# EAGLE board msp430f5528 (EAGLE 6.6.0), part 1 of 4
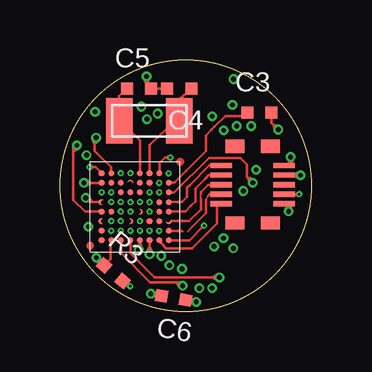
[diagram p5: board, top side]
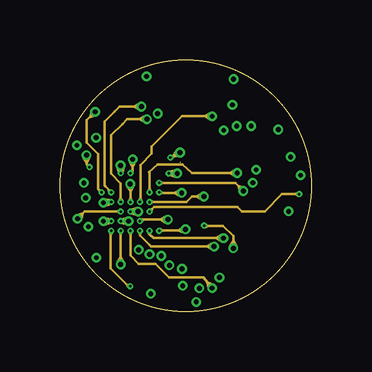
[diagram p6: board, inner layer Route2]
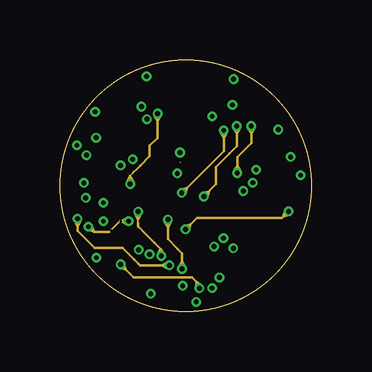
[diagram p7: board, inner layer Route3]
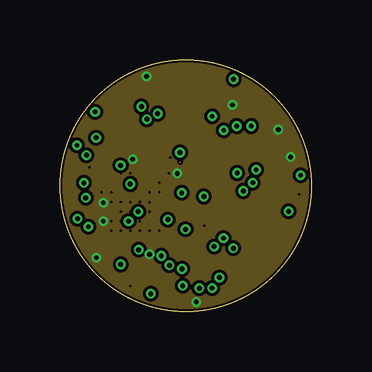
[diagram p8: board, inner layer Route14]
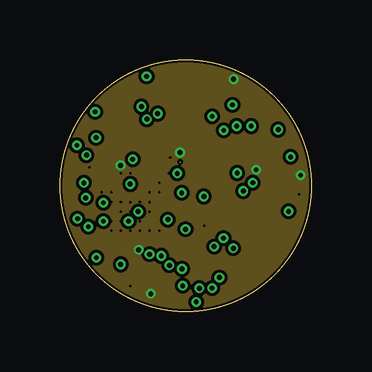
[diagram p9: board, inner layer Route15]
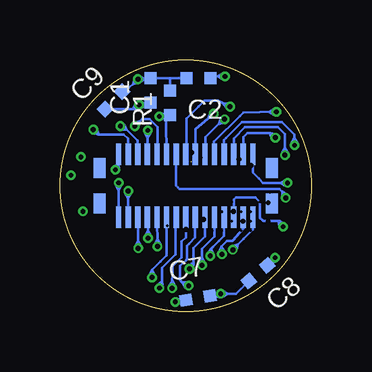
[diagram p10: board, bottom side, seen from below]

Size 10.5 x 10.5 mm. Coordinates in mm from the lower left corner, seen from the top.
Outline: 5.02,6.25 5.02,6.25
Outline: circle at 5.25,5.25 radius 5.25
Copper layers ([2:1+(2*3+14*15)*16]): Top 0.035mm / dielectric 0.2mm / Route2 0.035mm / dielectric 0.2mm / Route3 0.035mm / dielectric 0.2mm / Route14 0.035mm / dielectric 0.2mm / Route15 0.035mm / dielectric 0.2mm / Bottom 0.035mm
Design rules "6_layer_BGA *": minimum track width 0.1mm, minimum drill 0.08mm, track to track 0.081mm, track to pad 0.081mm, pad to pad 0.081mm, via to via 0.081mm, smd to smd 0mil, copper to edge 0.1mm, drill to drill 0.1mm, minimum pad ring 0.05mm, minimum via ring 0.05mm, stop-mask expansion 0mil, vias tented up to drill 10mil, thermal gap 10mil
tKeepout: area 4.7,6 to 5.3,6.5; area 1,2.5 to 1.6,3

## Footprints (pad centres in the part's own frame; a part is rotated, then mirrored left to right if it is on the bottom)
C0402 = smd 0.5 x 0.5: 1 -0.508,0; 2 0.508,0
R0402 = smd 0.5 x 0.5: 1 -0.508,0; 2 0.508,0
YFF64 = smd 0.25 x 0.25: A1 -1.4,1.4; A2 -1,1.4; A3 -0.6,1.4; A4 -0.2,1.4; A5 0.2,1.4; A6 0.6,1.4; A7 1,1.4; A8 1.4,1.4; B1 -1.4,1; B2 -1,1; B3 -0.6,1; B4 -0.2,1; B5 0.2,1; B6 0.6,1; B7 1,1; B8 1.4,1; C1 -1.4,0.6; C2 -1,0.6; C3 -0.6,0.6; C4 -0.2,0.6; C5 0.2,0.6; C6 0.6,0.6; C7 1,0.6; C8 1.4,0.6; D1 -1.4,0.2; D2 -1,0.2; D3 -0.6,0.2; D4 -0.2,0.2; D5 0.2,0.2; D6 0.6,0.2; D7 1,0.2; D8 1.4,0.2; E1 -1.4,-0.2; E2 -1,-0.2; E3 -0.6,-0.2; E4 -0.2,-0.2; E5 0.2,-0.2; E6 0.6,-0.2; E7 1,-0.2; E8 1.4,-0.2; F1 -1.4,-0.6; F2 -1,-0.6; F3 -0.6,-0.6; F4 -0.2,-0.6; F5 0.2,-0.6; F6 0.6,-0.6; F7 1,-0.6; F8 1.4,-0.6; G1 -1.4,-1; G2 -1,-1; G3 -0.6,-1; G4 -0.2,-1; G5 0.2,-1; G6 0.6,-1; G7 1,-1; G8 1.4,-1; H1 -1.4,-1.4; H2 -1,-1.4; H3 -0.6,-1.4; H4 -0.2,-1.4; H5 0.2,-1.4; H6 0.6,-1.4; H7 1,-1.4; H8 1.4,-1.4
ABS07 = smd 1.1 x 1.9: P$1 -1.25,0; P$2 1.25,0
55909-0374_PLUG = smd 0.9 x 0.22: P$1 -1.315,2.8; P$2 -1.315,2.4; P$3 -1.315,2; P$4 -1.315,1.6; P$5 -1.315,1.2; P$6 -1.315,0.8; P$7 -1.315,0.4; P$8 -1.315,0; P$9 -1.315,-0.4; P$10 -1.315,-0.8; P$11 -1.315,-1.2; P$12 -1.315,-1.6; P$13 -1.315,-2; P$14 -1.315,-2.4; P$15 -1.315,-2.8; P$16 1.315,-2.8; P$17 1.315,-2.4; P$18 1.315,-2; P$19 1.315,-1.6; P$20 1.315,-1.2; P$21 1.315,-0.8; P$22 1.315,-0.4; P$23 1.315,0; P$24 1.315,0.4; P$25 1.315,0.8; P$26 1.315,1.2; P$27 1.315,1.6; P$28 1.315,2; P$29 1.315,2.4; P$30 1.315,2.8 | smd 0.85 x 0.5: P$31 -0.74,-3.6; P$32 0.74,-3.6; P$33 -0.74,3.6; P$34 0.74,3.6
559099872_2X5_PLUG = smd 0.9 x 0.22: P$1 -1.315,0.8; P$2 -1.315,0.4; P$3 -1.315,0; P$4 -1.315,-0.4; P$5 -1.315,-0.8; P$6 1.315,-0.8; P$7 1.315,-0.4; P$8 1.315,0; P$9 1.315,0.4; P$10 1.315,0.8 | smd 0.8 x 0.55: P$11 -0.74,1.6; P$12 0.74,1.6; P$13 -0.74,-1.6; P$14 0.74,-1.6

## Placement (x,y rotation side)
C1  10u  [C0402]  6.72,9.22 90 bottom
C2  100n  [C0402]  4.72,9.75 180 bottom
C3  470n  [C0402]  8.33,8.3 0 top
C4  [C0402]  4.97,9.3 180 top
C5  [C0402]  3.3,9.3 0 top
C6  100n  [C0402]  4.74,0.57 170 top
C7  100n  [C0402]  4.74,0.57 10 bottom
C8  10u  [C0402]  2.23,1.6 220 bottom
C9  100n  [C0402]  8.26,8.81 45 bottom
R1  47k  [R0402]  5.9,8.72 90 bottom
R3  1M  [R0402]  2.23,1.6 320 top
U$1  MSP430F5528  [YFF64]  3.14,4.37 0 top
U$2  OSC32K  [ABS07]  3.72,7.96 0 top
U$4  55909-0374_PLUG  [55909-0374_PLUG]  5.25,5.25 270 bottom
U$5  559099872_2X5_PLUG  [559099872_2X5_PLUG]  8.04,5.29 180 top

## Tracks (layer width: path | path; a pad name or v marks a point on that pad's centre or on a via)
/RST  (via drill 0.1 pad 0.25 layers 1-2, 0.2 pad 0.4)
  Top 0.1: U$1.D5
  Route2 0.1: U$1.D5 3.37,4.66 3.37,4.79 3.36,4.94 3.36,6.11 3.83,6.58 3.83,6.88 5.1,8.15 v6.36,8.15 | 3.37,4.72 3.28,4.62 | U$1.D5 3.28,4.62 | 3.37,4.72 3.41,4.6 | U$1.D5 3.41,4.6 | 6.06,8.15 6.28,8.02 | v6.36,8.15 6.28,8.02 | 6.06,8.15 6.28,8.28 | v6.36,8.15 6.28,8.28 | 3.37,4.72 3.28,4.62 | U$1.D5 3.28,4.62 | 3.37,4.72 3.41,4.6 | U$1.D5 3.41,4.6 | 3.37,4.72 3.28,4.62 | U$1.D5 3.28,4.62 | 3.37,4.72 3.41,4.6 | U$1.D5 3.41,4.6 | 3.37,4.72 3.28,4.62 | U$1.D5 3.28,4.62 | 3.37,4.72 3.41,4.6 | U$1.D5 3.41,4.6 | 6.06,8.15 6.28,8.02 | v6.36,8.15 6.28,8.02 | 6.06,8.15 6.28,8.28 | v6.36,8.15 6.28,8.28 | 6.06,8.15 6.28,8.02 | v6.36,8.15 6.28,8.02 | 6.06,8.15 6.28,8.28 | v6.36,8.15 6.28,8.28 | 6.06,8.15 6.28,8.02 | v6.36,8.15 6.28,8.02 | 6.06,8.15 6.28,8.28 | v6.36,8.15 6.28,8.28 | 3.37,4.72 3.28,4.62 | U$1.D5 3.28,4.62 | 3.37,4.72 3.41,4.6 | U$1.D5 3.41,4.6 | 3.37,4.72 3.28,4.62 | U$1.D5 3.28,4.62 | 3.37,4.72 3.41,4.6 | U$1.D5 3.41,4.6 | 3.37,4.72 3.28,4.62 | U$1.D5 3.28,4.62 | 3.37,4.72 3.41,4.6 | U$1.D5 3.41,4.6 | 3.37,4.72 3.28,4.62 | U$1.D5 3.28,4.62 | 3.37,4.72 3.41,4.6 | U$1.D5 3.41,4.6 | 3.37,4.72 3.28,4.62 | U$1.D5 3.28,4.62 | 3.37,4.72 3.41,4.6 | U$1.D5 3.41,4.6 | 3.37,4.72 3.28,4.62 | U$1.D5 3.28,4.62 | 3.37,4.72 3.41,4.6 | U$1.D5 3.41,4.6 | 3.37,4.72 3.28,4.62 | U$1.D5 3.28,4.62 | 3.37,4.72 3.41,4.6 | U$1.D5 3.41,4.6 | 3.37,4.72 3.28,4.62 | U$1.D5 3.28,4.62 | 3.37,4.72 3.41,4.6 | U$1.D5 3.41,4.6 | 3.37,4.72 3.28,4.62 | U$1.D5 3.28,4.62 | 3.37,4.72 3.41,4.6 | U$1.D5 3.41,4.6 | 6.06,8.15 6.28,8.02 | v6.36,8.15 6.28,8.02 | 6.06,8.15 6.28,8.28 | v6.36,8.15 6.28,8.28 | 6.06,8.15 6.28,8.02 | v6.36,8.15 6.28,8.02 | 6.06,8.15 6.28,8.28 | v6.36,8.15 6.28,8.28 | 6.06,8.15 6.28,8.02 | v6.36,8.15 6.28,8.02 | 6.06,8.15 6.28,8.28 | v6.36,8.15 6.28,8.28
  Route2 0.1: 6.06,8.15 6.28,8.02 | v6.36,8.15 6.28,8.02 | 6.06,8.15 6.28,8.28 | v6.36,8.15 6.28,8.28 | 6.06,8.15 6.28,8.02 | v6.36,8.15 6.28,8.02 | 6.06,8.15 6.28,8.28 | v6.36,8.15 6.28,8.28 | 6.06,8.15 6.28,8.02 | v6.36,8.15 6.28,8.02 | 6.06,8.15 6.28,8.28 | v6.36,8.15 6.28,8.28 | 6.06,8.15 6.28,8.02 | v6.36,8.15 6.28,8.02 | 6.06,8.15 6.28,8.28 | v6.36,8.15 6.28,8.28 | 6.06,8.15 6.28,8.02 | v6.36,8.15 6.28,8.02 | 6.06,8.15 6.28,8.28 | v6.36,8.15 6.28,8.28 | 6.06,8.15 6.28,8.02 | v6.36,8.15 6.28,8.02 | 6.06,8.15 6.28,8.28 | v6.36,8.15 6.28,8.28
  Bottom 0.1: 5.86,8.16 v6.36,8.15 | 5.86,8.16 arc90 R1.1 | 5.86,8.16 6.07,7.96 U$4.P$10 | 6.06,8.16 6.28,8.02 | v6.36,8.15 6.28,8.02 | 6.06,8.16 6.29,8.28 | v6.36,8.15 6.29,8.28 | 6.06,8.16 6.28,8.02 | v6.36,8.15 6.28,8.02 | 6.06,8.16 6.29,8.28 | v6.36,8.15 6.29,8.28 | 6.06,8.16 6.28,8.02 | v6.36,8.15 6.28,8.02 | 6.06,8.16 6.29,8.28 | v6.36,8.15 6.29,8.28 | 6.06,8.16 6.28,8.02 | v6.36,8.15 6.28,8.02 | 6.06,8.16 6.29,8.28 | v6.36,8.15 6.29,8.28 | 6.06,8.16 6.28,8.02 | v6.36,8.15 6.28,8.02 | 6.06,8.16 6.29,8.28 | v6.36,8.15 6.29,8.28 | 6.06,8.16 6.28,8.02 | v6.36,8.15 6.28,8.02 | 6.06,8.16 6.29,8.28 | v6.36,8.15 6.29,8.28 | 6.06,8.16 6.28,8.02 | v6.36,8.15 6.28,8.02 | 6.06,8.16 6.29,8.28 | v6.36,8.15 6.29,8.28 | 6.06,8.16 6.28,8.02 | v6.36,8.15 6.28,8.02 | 6.06,8.16 6.29,8.28 | v6.36,8.15 6.29,8.28 | 6.06,8.16 6.28,8.02 | v6.36,8.15 6.28,8.02 | 6.06,8.16 6.29,8.28 | v6.36,8.15 6.29,8.28 | 6.06,8.16 6.28,8.02 | v6.36,8.15 6.28,8.02 | 6.06,8.16 6.29,8.28 | v6.36,8.15 6.29,8.28 | 6.06,8.16 6.28,8.02 | v6.36,8.15 6.28,8.02 | 6.06,8.16 6.29,8.28 | v6.36,8.15 6.29,8.28
  other vias: 3.34,4.57
GND  (via drill 0.1 pad 0.25 layers 1-2, 0.2 pad 0.4, 0.2 pad 0.4 layers 2-15)
  Top 0.1: C7.1 v5.69,0.4 | U$1.H6 3.74,2.59 v3.74,2.39 | C4.2 4.37,9.3 3.96,9.3 C5.2 | U$5.P$5 9.63,6.09 v9.63,6.45 | C3.2 8.83,7.87 v9.11,7.59 | U$1.H2 2.12,2.96 2.12,2.49 2.12,2.21 C8.1 1.75,1.93 v1.52,2.25 | C5.2 3.75,9.42 | v3.61,9.81 3.62,9.5 C5.2 | 5.39,0.46 5.59,0.29 | v5.69,0.4 5.59,0.29 | 5.39,0.46 5.64,0.54 | v5.69,0.4 5.64,0.54 | 3.74,2.69 3.61,2.46 | v3.74,2.39 3.61,2.46 | 3.74,2.69 3.87,2.46 | v3.74,2.39 3.87,2.46 | 8.9,7.8 8.96,7.55 | v9.11,7.59 8.96,7.55 | 8.9,7.8 9.15,7.74 | v9.11,7.59 9.15,7.74 | 3.62,9.51 3.74,9.74 | v3.61,9.81 3.74,9.74 | 3.62,9.51 3.48,9.74 | v3.61,9.81 3.48,9.74 | 9.63,6.15 9.76,6.38 | v9.63,6.45 9.76,6.38 | 9.63,6.15 9.5,6.38 | v9.63,6.45 9.5,6.38 | 1.69,2 1.67,2.26 | v1.52,2.25 1.67,2.26 | 1.69,2 1.46,2.12 | v1.52,2.25 1.46,2.12 | v3.74,2.39 | v3.74,2.39 | 5.39,0.46 5.59,0.29 | v5.69,0.4 5.59,0.29 | 5.39,0.46 5.64,0.54 | v5.69,0.4 5.64,0.54 | 5.39,0.46 5.59,0.29 | v5.69,0.4 5.59,0.29 | 5.39,0.46 5.64,0.54 | v5.69,0.4 5.64,0.54 | 5.39,0.46 5.59,0.29 | v5.69,0.4 5.59,0.29 | 5.39,0.46 5.64,0.54 | v5.69,0.4 5.64,0.54 | 3.74,2.69 3.61,2.46 | v3.74,2.39 3.61,2.46 | 3.74,2.69 3.87,2.46 | v3.74,2.39 3.87,2.46 | 3.74,2.69 3.61,2.46 | v3.74,2.39 3.61,2.46 | 3.74,2.69 3.87,2.46 | v3.74,2.39 3.87,2.46 | 3.74,2.69 3.61,2.46 | v3.74,2.39 3.61,2.46 | 3.74,2.69 3.87,2.46 | v3.74,2.39 3.87,2.46 | 8.9,7.8 8.96,7.55 | v9.11,7.59 8.96,7.55 | 8.9,7.8 9.15,7.74 | v9.11,7.59 9.15,7.74 | 8.9,7.8 8.96,7.55 | v9.11,7.59 8.96,7.55 | 8.9,7.8 9.15,7.74 | v9.11,7.59 9.15,7.74 | 8.9,7.8 8.96,7.55 | v9.11,7.59 8.96,7.55 | 8.9,7.8 9.15,7.74 | v9.11,7.59 9.15,7.74 | 3.62,9.51 3.74,9.74 | v3.61,9.81 3.74,9.74 | 3.62,9.51 3.48,9.74 | v3.61,9.81 3.48,9.74 | 3.62,9.51 3.74,9.74 | v3.61,9.81 3.74,9.74 | 3.62,9.51 3.48,9.74
  Top 0.1: v3.61,9.81 3.48,9.74 | 3.62,9.51 3.74,9.74 | v3.61,9.81 3.74,9.74 | 3.62,9.51 3.48,9.74 | v3.61,9.81 3.48,9.74 | 9.63,6.15 9.76,6.38 | v9.63,6.45 9.76,6.38 | 9.63,6.15 9.5,6.38 | v9.63,6.45 9.5,6.38 | 9.63,6.15 9.76,6.38 | v9.63,6.45 9.76,6.38 | 9.63,6.15 9.5,6.38 | v9.63,6.45 9.5,6.38 | 9.63,6.15 9.76,6.38 | v9.63,6.45 9.76,6.38 | 9.63,6.15 9.5,6.38 | v9.63,6.45 9.5,6.38 | 1.69,2 1.67,2.26 | v1.52,2.25 1.67,2.26 | 1.69,2 1.46,2.12 | v1.52,2.25 1.46,2.12 | 1.69,2 1.67,2.26 | v1.52,2.25 1.67,2.26 | 1.69,2 1.46,2.12 | v1.52,2.25 1.46,2.12 | 1.69,2 1.67,2.26 | v1.52,2.25 1.67,2.26 | 1.69,2 1.46,2.12 | v1.52,2.25 1.46,2.12 | U$1.A8 | U$1.A8 | 5.39,0.46 5.59,0.29 | v5.69,0.4 5.59,0.29 | 5.39,0.46 5.64,0.54 | v5.69,0.4 5.64,0.54 | 5.39,0.46 5.59,0.29 | v5.69,0.4 5.59,0.29 | 5.39,0.46 5.64,0.54 | v5.69,0.4 5.64,0.54 | 5.39,0.46 5.59,0.29 | v5.69,0.4 5.59,0.29 | 5.39,0.46 5.64,0.54 | v5.69,0.4 5.64,0.54 | 5.39,0.46 5.59,0.29 | v5.69,0.4 5.59,0.29 | 5.39,0.46 5.64,0.54 | v5.69,0.4 5.64,0.54 | 5.39,0.46 5.59,0.29 | v5.69,0.4 5.59,0.29 | 5.39,0.46 5.64,0.54 | v5.69,0.4 5.64,0.54 | 5.39,0.46 5.59,0.29 | v5.69,0.4 5.59,0.29 | 5.39,0.46 5.64,0.54 | v5.69,0.4 5.64,0.54 | 5.39,0.46 5.59,0.29 | v5.69,0.4 5.59,0.29 | 5.39,0.46 5.64,0.54 | v5.69,0.4 5.64,0.54 | 5.39,0.46 5.59,0.29 | v5.69,0.4 5.59,0.29 | 5.39,0.46 5.64,0.54 | v5.69,0.4 5.64,0.54 | 5.39,0.46 5.59,0.29 | v5.69,0.4 5.59,0.29 | 5.39,0.46 5.64,0.54 | v5.69,0.4 5.64,0.54 | 3.74,2.69 3.61,2.46 | v3.74,2.39 3.61,2.46 | 3.74,2.69 3.87,2.46 | v3.74,2.39 3.87,2.46 | 3.74,2.69 3.61,2.46 | v3.74,2.39 3.61,2.46 | 3.74,2.69 3.87,2.46 | v3.74,2.39 3.87,2.46 | 3.74,2.69 3.61,2.46 | v3.74,2.39 3.61,2.46 | 3.74,2.69 3.87,2.46 | v3.74,2.39 3.87,2.46 | 3.74,2.69 3.61,2.46 | v3.74,2.39 3.61,2.46
  Top 0.1: 3.74,2.69 3.87,2.46 | v3.74,2.39 3.87,2.46 | 3.74,2.69 3.61,2.46 | v3.74,2.39 3.61,2.46 | 3.74,2.69 3.87,2.46 | v3.74,2.39 3.87,2.46 | 3.74,2.69 3.61,2.46 | v3.74,2.39 3.61,2.46 | 3.74,2.69 3.87,2.46 | v3.74,2.39 3.87,2.46 | 3.74,2.69 3.61,2.46 | v3.74,2.39 3.61,2.46 | 3.74,2.69 3.87,2.46 | v3.74,2.39 3.87,2.46 | 3.74,2.69 3.61,2.46 | v3.74,2.39 3.61,2.46 | 3.74,2.69 3.87,2.46 | v3.74,2.39 3.87,2.46 | 3.74,2.69 3.61,2.46 | v3.74,2.39 3.61,2.46 | 3.74,2.69 3.87,2.46 | v3.74,2.39 3.87,2.46 | 8.9,7.8 8.96,7.55 | v9.11,7.59 8.96,7.55 | 8.9,7.8 9.15,7.74 | v9.11,7.59 9.15,7.74 | 8.9,7.8 8.96,7.55 | v9.11,7.59 8.96,7.55 | 8.9,7.8 9.15,7.74 | v9.11,7.59 9.15,7.74 | 8.9,7.8 8.96,7.55 | v9.11,7.59 8.96,7.55 | 8.9,7.8 9.15,7.74 | v9.11,7.59 9.15,7.74 | 8.9,7.8 8.96,7.55 | v9.11,7.59 8.96,7.55 | 8.9,7.8 9.15,7.74 | v9.11,7.59 9.15,7.74 | 8.9,7.8 8.96,7.55 | v9.11,7.59 8.96,7.55 | 8.9,7.8 9.15,7.74 | v9.11,7.59 9.15,7.74 | 8.9,7.8 8.96,7.55 | v9.11,7.59 8.96,7.55 | 8.9,7.8 9.15,7.74 | v9.11,7.59 9.15,7.74 | 8.9,7.8 8.96,7.55 | v9.11,7.59 8.96,7.55 | 8.9,7.8 9.15,7.74 | v9.11,7.59 9.15,7.74 | 3.62,9.51 3.74,9.74 | v3.61,9.81 3.74,9.74 | 3.62,9.51 3.48,9.74 | v3.61,9.81 3.48,9.74 | 3.62,9.51 3.74,9.74 | v3.61,9.81 3.74,9.74 | 3.62,9.51 3.48,9.74 | v3.61,9.81 3.48,9.74 | 3.62,9.51 3.74,9.74 | v3.61,9.81 3.74,9.74 | 3.62,9.51 3.48,9.74 | v3.61,9.81 3.48,9.74 | 3.62,9.51 3.74,9.74 | v3.61,9.81 3.74,9.74 | 3.62,9.51 3.48,9.74 | v3.61,9.81 3.48,9.74 | 3.62,9.51 3.74,9.74 | v3.61,9.81 3.74,9.74 | 3.62,9.51 3.48,9.74 | v3.61,9.81 3.48,9.74 | 3.62,9.51 3.74,9.74 | v3.61,9.81 3.74,9.74 | 3.62,9.51 3.48,9.74 | v3.61,9.81 3.48,9.74 | 3.62,9.51 3.74,9.74 | v3.61,9.81 3.74,9.74 | 3.62,9.51 3.48,9.74 | v3.61,9.81 3.48,9.74 | 3.62,9.51 3.74,9.74
  Top 0.1: v3.61,9.81 3.74,9.74 | 3.62,9.51 3.48,9.74 | v3.61,9.81 3.48,9.74 | 3.62,9.51 3.74,9.74 | v3.61,9.81 3.74,9.74 | 3.62,9.51 3.48,9.74 | v3.61,9.81 3.48,9.74 | 9.63,6.15 9.76,6.38 | v9.63,6.45 9.76,6.38 | 9.63,6.15 9.5,6.38 | v9.63,6.45 9.5,6.38 | 9.63,6.15 9.76,6.38 | v9.63,6.45 9.76,6.38 | 9.63,6.15 9.5,6.38 | v9.63,6.45 9.5,6.38 | 9.63,6.15 9.76,6.38 | v9.63,6.45 9.76,6.38 | 9.63,6.15 9.5,6.38 | v9.63,6.45 9.5,6.38 | 9.63,6.15 9.76,6.38 | v9.63,6.45 9.76,6.38 | 9.63,6.15 9.5,6.38 | v9.63,6.45 9.5,6.38 | 9.63,6.15 9.76,6.38 | v9.63,6.45 9.76,6.38 | 9.63,6.15 9.5,6.38 | v9.63,6.45 9.5,6.38 | 9.63,6.15 9.76,6.38 | v9.63,6.45 9.76,6.38 | 9.63,6.15 9.5,6.38 | v9.63,6.45 9.5,6.38 | 9.63,6.15 9.76,6.38 | v9.63,6.45 9.76,6.38 | 9.63,6.15 9.5,6.38 | v9.63,6.45 9.5,6.38 | 9.63,6.15 9.76,6.38 | v9.63,6.45 9.76,6.38 | 9.63,6.15 9.5,6.38 | v9.63,6.45 9.5,6.38 | 9.63,6.15 9.76,6.38 | v9.63,6.45 9.76,6.38 | 9.63,6.15 9.5,6.38 | v9.63,6.45 9.5,6.38 | 1.69,2 1.67,2.26 | v1.52,2.25 1.67,2.26 | 1.69,2 1.46,2.12 | v1.52,2.25 1.46,2.12 | 1.69,2 1.67,2.26 | v1.52,2.25 1.67,2.26 | 1.69,2 1.46,2.12 | v1.52,2.25 1.46,2.12 | 1.69,2 1.67,2.26 | v1.52,2.25 1.67,2.26 | 1.69,2 1.46,2.12 | v1.52,2.25 1.46,2.12 | 1.69,2 1.67,2.26 | v1.52,2.25 1.67,2.26 | 1.69,2 1.46,2.12 | v1.52,2.25 1.46,2.12 | 1.69,2 1.67,2.26 | v1.52,2.25 1.67,2.26 | 1.69,2 1.46,2.12 | v1.52,2.25 1.46,2.12 | 1.69,2 1.67,2.26 | v1.52,2.25 1.67,2.26 | 1.69,2 1.46,2.12 | v1.52,2.25 1.46,2.12 | 1.69,2 1.67,2.26 | v1.52,2.25 1.67,2.26 | 1.69,2 1.46,2.12 | v1.52,2.25 1.46,2.12 | 1.69,2 1.67,2.26 | v1.52,2.25 1.67,2.26 | 1.69,2 1.46,2.12 | v1.52,2.25 1.46,2.12 | 1.69,2 1.67,2.26 | v1.52,2.25 1.67,2.26 | 1.69,2 1.46,2.12 | v1.52,2.25 1.46,2.12 | U$1.A4 | U$1.F2 | U$1.D2
  Route2 0.1: U$1.D2 1.87,4.57 v1.81,4.54 | U$1.F2 v1.81,3.77 | U$1.A8 4.66,5.77 v4.89,5.76 | U$1.A4 2.97,5.8 | 2.97,5.8 3.04,5.87 v3.04,6.35 | 3.04,5.89 2.91,5.84 | U$1.A4 2.91,5.84 | 3.04,5.89 3.01,5.76 | U$1.A4 3.01,5.76 | 3.04,6.05 3.17,6.28 | v3.04,6.35 3.17,6.28 | 3.04,6.05 2.91,6.28 | v3.04,6.35 2.91,6.28 | 1.99,4.57 2.1,4.5 | U$1.D2 2.11,4.52 | 2.11,4.52 2.1,4.5 | 1.99,4.57 2.1,4.63 | U$1.D2 2.1,4.63 | 2.11,4.56 1.88,4.68 | v1.81,4.54 1.88,4.68 | 2.11,4.56 1.9,4.42 | v1.81,4.54 1.9,4.42 | 1.99,3.77 2.1,3.71 | U$1.F2 2.1,3.71 | 1.99,3.77 2.1,3.84 | U$1.F2 2.1,3.84 | 2.11,3.77 1.89,3.9 | v1.81,3.77 1.89,3.9 | 2.11,3.77 1.89,3.64 | v1.81,3.77 1.89,3.64 | 4.69,5.77 4.58,5.83 | U$1.A8 4.58,5.83 | 4.69,5.77 4.58,5.7 | U$1.A8 4.58,5.7 | 4.59,5.77 4.82,5.64 | v4.89,5.76 4.82,5.64 | 4.59,5.77 4.82,5.9 | v4.89,5.76 4.82,5.9 | 3.04,5.89 2.91,5.84 | U$1.A4 2.91,5.84 | 3.04,5.89 3.01,5.76 | U$1.A4 3.01,5.76 | 3.04,5.89 2.91,5.84 | U$1.A4 2.91,5.84 | 3.04,5.89 3.01,5.76 | U$1.A4 3.01,5.76 | 3.04,5.89 2.91,5.84 | U$1.A4 2.91,5.84 | 3.04,5.89 3.01,5.76 | U$1.A4 3.01,5.76 | 3.04,6.05 3.17,6.28 | v3.04,6.35 3.17,6.28 | 3.04,6.05 2.91,6.28 | v3.04,6.35 2.91,6.28 | 3.04,6.05 3.17,6.28 | v3.04,6.35 3.17,6.28 | 3.04,6.05 2.91,6.28 | v3.04,6.35 2.91,6.28 | 3.04,6.05 3.17,6.28 | v3.04,6.35 3.17,6.28 | 3.04,6.05 2.91,6.28 | v3.04,6.35 2.91,6.28 | 1.99,4.57 2.1,4.5 | U$1.D2 2.11,4.52 | 2.11,4.52 2.1,4.5 | 1.99,4.57 2.1,4.63 | U$1.D2 2.1,4.63 | 1.99,4.57 2.1,4.5 | U$1.D2 2.1,4.5 | 1.99,4.57 2.1,4.63 | U$1.D2 2.1,4.63 | 1.99,4.57 2.1,4.5 | U$1.D2 2.1,4.5 | 1.99,4.57 2.1,4.63 | U$1.D2 2.1,4.63 | 2,4.62 2.08,4.52 | U$1.D2 2.08,4.52 | 2,4.62 2.12,4.64 | U$1.D2 2.12,4.64 | 2.01,4.5 2.14,4.5 | U$1.D2 2.14,4.5 | 2.01,4.5 2.07,4.61 | U$1.D2 2.07,4.61 | 2.11,4.56 1.88,4.68
  Route2 0.1: v1.81,4.54 1.88,4.68 | 2.11,4.56 1.9,4.42 | v1.81,4.54 1.9,4.42 | 2.11,4.52 1.9,4.66 | v1.81,4.54 1.9,4.66 | 2.11,4.52 1.88,4.41 | v1.81,4.54 1.88,4.41 | 2.1,4.63 1.84,4.69 | v1.81,4.54 1.84,4.69 | 2.1,4.63 1.92,4.44 | v1.81,4.54 1.92,4.44 | 2.11,4.56 1.88,4.68 | v1.81,4.54 1.88,4.68 | 2.11,4.56 1.9,4.42 | v1.81,4.54 1.9,4.42 | 2.11,4.56 1.88,4.68 | v1.81,4.54 1.88,4.68 | 2.11,4.56 1.9,4.42 | v1.81,4.54 1.9,4.42 | 1.99,3.77 2.1,3.71 | U$1.F2 2.1,3.71 | 1.99,3.77 2.1,3.84 | U$1.F2 2.1,3.84 | 1.99,3.77 2.1,3.71 | U$1.F2 2.1,3.71 | 1.99,3.77 2.1,3.84 | U$1.F2 2.1,3.84 | 1.99,3.77 2.1,3.71 | U$1.F2 2.1,3.71 | 1.99,3.77 2.1,3.84 | U$1.F2 2.1,3.84 | 2,3.83 2.08,3.73 | U$1.F2 2.08,3.73 | 2,3.83 2.13,3.85 | U$1.F2 2.13,3.85 | 2,3.71 2.13,3.7 | U$1.F2 2.13,3.7 | 2,3.71 2.08,3.81 | U$1.F2 2.08,3.81 | 2.11,3.77 1.89,3.9 | v1.81,3.77 1.89,3.9 | 2.11,3.77 1.89,3.64 | v1.81,3.77 1.89,3.64 | 2.11,3.71 1.91,3.88 | v1.81,3.77 1.91,3.88 | 2.11,3.71 1.86,3.63 | v1.81,3.77 1.86,3.63 | 2.11,3.83 1.86,3.91 | v1.81,3.77 1.86,3.91 | 2.11,3.83 1.91,3.66 | v1.81,3.77 1.91,3.66 | 2.11,3.77 1.89,3.9 | v1.81,3.77 1.89,3.9 | 2.11,3.77 1.89,3.64 | v1.81,3.77 1.89,3.64 | 2.11,3.77 1.89,3.9 | v1.81,3.77 1.89,3.9 | 2.11,3.77 1.89,3.64 | v1.81,3.77 1.89,3.64 | 4.69,5.77 4.58,5.83 | U$1.A8 4.58,5.83 | 4.69,5.77 4.58,5.7 | U$1.A8 4.58,5.7 | 4.69,5.77 4.58,5.83 | U$1.A8 4.58,5.83 | 4.69,5.77 4.58,5.7 | U$1.A8 4.58,5.7 | 4.69,5.77 4.58,5.83 | U$1.A8 4.58,5.83 | 4.69,5.77 4.58,5.7 | U$1.A8 4.58,5.7 | 4.68,5.72 4.6,5.82 | U$1.A8 4.6,5.82 | 4.68,5.72 4.55,5.7 | U$1.A8 4.55,5.7 | 4.68,5.82 4.56,5.84 | U$1.A8 4.56,5.84 | 4.68,5.82 4.6,5.72 | U$1.A8 4.6,5.72 | 4.59,5.77 4.82,5.64 | v4.89,5.76 4.82,5.64 | 4.59,5.77 4.82,5.9 | v4.89,5.76 4.82,5.9 | 4.6,5.82 4.8,5.65 | v4.89,5.76 4.8,5.65
  Route2 0.1: 4.6,5.82 4.84,5.91 | v4.89,5.76 4.84,5.91 | 4.6,5.72 4.84,5.62 | v4.89,5.76 4.84,5.62 | 4.6,5.72 4.8,5.88 | v4.89,5.76 4.8,5.88 | 4.59,5.77 4.82,5.64 | v4.89,5.76 4.82,5.64 | 4.59,5.77 4.82,5.9 | v4.89,5.76 4.82,5.9 | 4.59,5.77 4.82,5.64 | v4.89,5.76 4.82,5.64 | 4.59,5.77 4.82,5.9 | v4.89,5.76 4.82,5.9 | 4.6,5.82 4.59,5.82 U$1.A8 | 3.04,5.89 2.91,5.84 | U$1.A4 2.91,5.84 | 3.04,5.89 3.01,5.76 | U$1.A4 3.01,5.76 | 3.04,5.89 2.91,5.84 | U$1.A4 2.91,5.84 | 3.04,5.89 3.01,5.76 | U$1.A4 3.01,5.76 | 3.04,5.89 2.91,5.84 | U$1.A4 2.91,5.84 | 3.04,5.89 3.01,5.76 | U$1.A4 3.01,5.76 | 3.04,5.89 2.91,5.84 | U$1.A4 2.91,5.84 | 3.04,5.89 3.01,5.76 | U$1.A4 3.01,5.76 | 3.04,5.89 2.91,5.84 | U$1.A4 2.91,5.84 | 3.04,5.89 3.01,5.76 | U$1.A4 3.01,5.76 | 3.04,5.89 2.91,5.84 | U$1.A4 2.91,5.84 | 3.04,5.89 3.01,5.76 | U$1.A4 3.01,5.76 | 3.04,5.89 2.91,5.84 | U$1.A4 2.91,5.84 | 3.04,5.89 3.01,5.76 | U$1.A4 3.01,5.76 | 3.04,5.89 2.91,5.84 | U$1.A4 2.91,5.84 | 3.04,5.89 3.01,5.76 | U$1.A4 3.01,5.76 | 3.04,5.89 2.91,5.84 | U$1.A4 2.91,5.84 | 3.04,5.89 3.01,5.76 | U$1.A4 3.01,5.76 | 3.04,6.05 3.17,6.28 | v3.04,6.35 3.17,6.28 | 3.04,6.05 2.91,6.28 | v3.04,6.35 2.91,6.28 | 3.04,6.05 3.17,6.28 | v3.04,6.35 3.17,6.28 | 3.04,6.05 2.91,6.28 | v3.04,6.35 2.91,6.28 | 3.04,6.05 3.17,6.28 | v3.04,6.35 3.17,6.28 | 3.04,6.05 2.91,6.28 | v3.04,6.35 2.91,6.28 | 3.04,6.05 3.17,6.28 | v3.04,6.35 3.17,6.28 | 3.04,6.05 2.91,6.28 | v3.04,6.35 2.91,6.28 | 3.04,6.05 3.17,6.28 | v3.04,6.35 3.17,6.28 | 3.04,6.05 2.91,6.28 | v3.04,6.35 2.91,6.28 | 3.04,6.05 3.17,6.28 | v3.04,6.35 3.17,6.28 | 3.04,6.05 2.91,6.28 | v3.04,6.35 2.91,6.28 | 3.04,6.05 3.17,6.28 | v3.04,6.35 3.17,6.28 | 3.04,6.05 2.91,6.28 | v3.04,6.35 2.91,6.28 | 3.04,6.05 3.17,6.28 | v3.04,6.35 3.17,6.28
  Route2 0.1: 3.04,6.05 2.91,6.28 | v3.04,6.35 2.91,6.28 | 3.04,6.05 3.17,6.28 | v3.04,6.35 3.17,6.28 | 3.04,6.05 2.91,6.28 | v3.04,6.35 2.91,6.28 | 1.99,4.57 2.1,4.5 | U$1.D2 2.11,4.52 | 2.11,4.52 2.1,4.5 | 1.99,4.57 2.1,4.63 | U$1.D2 2.1,4.63 | 1.99,4.57 2.1,4.5 | U$1.D2 2.1,4.5 | 1.99,4.57 2.1,4.63 | U$1.D2 2.1,4.63 | 1.99,4.57 2.1,4.5 | U$1.D2 2.1,4.5 | 1.99,4.57 2.1,4.63 | U$1.D2 2.1,4.63 | 2,4.62 2.08,4.52 | U$1.D2 2.08,4.52 | 2,4.62 2.12,4.64 | U$1.D2 2.12,4.64 | 2.01,4.5 2.14,4.5 | U$1.D2 2.14,4.5 | 2.01,4.5 2.07,4.61 | U$1.D2 2.07,4.61 | 1.99,4.57 2.1,4.5 | U$1.D2 2.1,4.5 | 1.99,4.57 2.1,4.63 | U$1.D2 2.1,4.63 | 1.99,4.57 2.1,4.5 | U$1.D2 2.1,4.5 | 1.99,4.57 2.1,4.63 | U$1.D2 2.1,4.63 | 1.99,4.57 2.1,4.5 | U$1.D2 2.1,4.5 | 1.99,4.57 2.1,4.63 | U$1.D2 2.1,4.63 | 1.99,4.57 2.1,4.5 | U$1.D2 2.1,4.5 | 1.99,4.57 2.1,4.63 | U$1.D2 2.1,4.63 | 1.99,4.57 2.1,4.5 | U$1.D2 2.1,4.5 | 1.99,4.57 2.1,4.63 | U$1.D2 2.1,4.63 | 1.99,4.57 2.1,4.5 | U$1.D2 2.1,4.5 | 1.99,4.57 2.1,4.63 | U$1.D2 2.1,4.63 | 2,4.62 2.08,4.52 | U$1.D2 2.08,4.52 | 2,4.62 2.12,4.64 | U$1.D2 2.12,4.64 | 2,4.62 2.08,4.52 | U$1.D2 2.08,4.52 | 2,4.62 2.12,4.64 | U$1.D2 2.12,4.64 | 2.01,4.5 2.14,4.5 | U$1.D2 2.14,4.5 | 2.01,4.5 2.07,4.61 | U$1.D2 2.07,4.61 | 2.01,4.5 2.14,4.5 | U$1.D2 2.14,4.5 | 2.01,4.5 2.07,4.61 | U$1.D2 2.07,4.61 | 2,4.62 2.08,4.52 | U$1.D2 2.08,4.52 | 2,4.62 2.12,4.64 | U$1.D2 2.12,4.64 | 2.01,4.5 2.14,4.5 | U$1.D2 2.14,4.5 | 2.01,4.5 2.07,4.61 | U$1.D2 2.07,4.61 | U$1.D2 2.09,4.51 1.99,4.6 2.12,4.64 U$1.D2 | U$1.D2 2.15,4.5 2.02,4.48 2.07,4.6 U$1.D2 | U$1.D2 2.07,4.54 2.01,4.65 2.14,4.65 U$1.D2 | U$1.D2 2.12,4.5 2,4.52 2.08,4.62 U$1.D2 | 2,4.62 2.08,4.52 | U$1.D2 2.08,4.52 | 2,4.62 2.12,4.64 | U$1.D2 2.12,4.64 | 2.01,4.5 2.14,4.5 | U$1.D2 2.14,4.5 | 2.01,4.5 2.07,4.61
  Route2 0.1: U$1.D2 2.07,4.61 | 2,4.62 2.08,4.52 | U$1.D2 2.08,4.52 | 2,4.62 2.12,4.64 | U$1.D2 2.12,4.64 | 2.01,4.5 2.14,4.5 | U$1.D2 2.14,4.5 | 2.01,4.5 2.07,4.61 | U$1.D2 2.07,4.61 | 2.11,4.56 1.88,4.68 | v1.81,4.54 1.88,4.68 | 2.11,4.56 1.9,4.42 | v1.81,4.54 1.9,4.42 | 2.11,4.52 1.9,4.66 | v1.81,4.54 1.9,4.66 | 2.11,4.52 1.88,4.41 | v1.81,4.54 1.88,4.41 | 2.1,4.63 1.84,4.69 | v1.81,4.54 1.84,4.69 | 2.1,4.63 1.92,4.44 | v1.81,4.54 1.92,4.44 | 2.11,4.56 1.88,4.68 | v1.81,4.54 1.88,4.68 | 2.11,4.56 1.9,4.42 | v1.81,4.54 1.9,4.42 | 2.11,4.56 1.88,4.68 | v1.81,4.54 1.88,4.68 | 2.11,4.56 1.9,4.42 | v1.81,4.54 1.9,4.42 | 2.11,4.52 1.9,4.66 | v1.81,4.54 1.9,4.66 | 2.11,4.52 1.88,4.41 | v1.81,4.54 1.88,4.41 | 2.1,4.63 1.84,4.69 | v1.81,4.54 1.84,4.69 | 2.1,4.63 1.92,4.44 | v1.81,4.54 1.92,4.44 | 2.11,4.52 1.9,4.66 | v1.81,4.54 1.9,4.66 | 2.11,4.52 1.88,4.41 | v1.81,4.54 1.88,4.41 | 2.1,4.63 1.84,4.69 | v1.81,4.54 1.84,4.69 | 2.1,4.63 1.92,4.44 | v1.81,4.54 1.92,4.44 | 2.11,4.52 1.9,4.66 | v1.81,4.54 1.9,4.66 | 2.11,4.52 1.88,4.41 | v1.81,4.54 1.88,4.41 | 2.1,4.63 1.84,4.69 | v1.81,4.54 1.84,4.69 | 2.1,4.63 1.92,4.44 | v1.81,4.54 1.92,4.44 | v1.81,4.54 1.88,4.67 2.11,4.55 1.89,4.41 v1.81,4.54 | v1.81,4.54 1.84,4.69 2.1,4.64 1.92,4.44 v1.81,4.54 | v1.81,4.54 1.9,4.66 2.11,4.5 1.87,4.4 v1.81,4.54 | v1.81,4.54 1.86,4.68 2.11,4.59 1.91,4.42 v1.81,4.54 | 2.11,4.56 1.88,4.68 | v1.81,4.54 1.88,4.68 | 2.11,4.56 1.9,4.42 | v1.81,4.54 1.9,4.42 | 2.11,4.56 1.88,4.68 | v1.81,4.54 1.88,4.68 | 2.11,4.56 1.9,4.42 | v1.81,4.54 1.9,4.42 | 2.11,4.52 1.9,4.66 | v1.81,4.54 1.9,4.66 | 2.11,4.52 1.88,4.41 | v1.81,4.54 1.88,4.41 | 2.11,4.52 1.9,4.66 | v1.81,4.54 1.9,4.66 | 2.11,4.52 1.88,4.41 | v1.81,4.54 1.88,4.41 | 2.1,4.63 1.84,4.69
  Route2 0.1: v1.81,4.54 1.84,4.69 | 2.1,4.63 1.92,4.44 | v1.81,4.54 1.92,4.44 | 2.1,4.63 1.84,4.69 | v1.81,4.54 1.84,4.69 | 2.1,4.63 1.92,4.44 | v1.81,4.54 1.92,4.44 | 2.11,4.56 1.88,4.68 | v1.81,4.54 1.88,4.68 | 2.11,4.56 1.9,4.42 | v1.81,4.54 1.9,4.42 | 2.11,4.56 1.88,4.68 | v1.81,4.54 1.88,4.68 | 2.11,4.56 1.9,4.42 | v1.81,4.54 1.9,4.42 | 2.11,4.56 1.88,4.68 | v1.81,4.54 1.88,4.68 | 2.11,4.56 1.9,4.42 | v1.81,4.54 1.9,4.42 | 2.11,4.56 1.88,4.68 | v1.81,4.54 1.88,4.68 | 2.11,4.56 1.9,4.42 | v1.81,4.54 1.9,4.42 | 1.99,3.77 2.1,3.71 | U$1.F2 2.1,3.71 | 1.99,3.77 2.1,3.84 | U$1.F2 2.1,3.84 | 1.99,3.77 2.1,3.71 | U$1.F2 2.1,3.71 | 1.99,3.77 2.1,3.84 | U$1.F2 2.1,3.84 | 1.99,3.77 2.1,3.71 | U$1.F2 2.1,3.71 | 1.99,3.77 2.1,3.84 | U$1.F2 2.1,3.84 | 2,3.83 2.08,3.73 | U$1.F2 2.08,3.73 | 2,3.83 2.13,3.85 | U$1.F2 2.13,3.85 | 2,3.71 2.13,3.7 | U$1.F2 2.13,3.7 | 2,3.71 2.08,3.81 | U$1.F2 2.08,3.81 | 1.99,3.77 2.1,3.71 | U$1.F2 2.1,3.71 | 1.99,3.77 2.1,3.84 | U$1.F2 2.1,3.84 | 1.99,3.77 2.1,3.71 | U$1.F2 2.1,3.71 | 1.99,3.77 2.1,3.84 | U$1.F2 2.1,3.84 | 1.99,3.77 2.1,3.71 | U$1.F2 2.1,3.71 | 1.99,3.77 2.1,3.84 | U$1.F2 2.1,3.84 | 1.99,3.77 2.1,3.71 | U$1.F2 2.1,3.71 | 1.99,3.77 2.1,3.84 | U$1.F2 2.1,3.84 | 1.99,3.77 2.1,3.71 | U$1.F2 2.1,3.71 | 1.99,3.77 2.1,3.84 | U$1.F2 2.1,3.84 | 1.99,3.77 2.1,3.71 | U$1.F2 2.1,3.71 | 1.99,3.77 2.1,3.84 | U$1.F2 2.1,3.84 | 2,3.83 2.08,3.73 | U$1.F2 2.08,3.73 | 2,3.83 2.13,3.85 | U$1.F2 2.13,3.85 | 2,3.83 2.08,3.73 | U$1.F2 2.08,3.73 | 2,3.83 2.13,3.85 | U$1.F2 2.13,3.85 | 2,3.71 2.13,3.7 | U$1.F2 2.13,3.7 | 2,3.71 2.08,3.81 | U$1.F2 2.08,3.81 | 2,3.71 2.13,3.7 | U$1.F2 2.13,3.7 | 2,3.71 2.08,3.81 | U$1.F2 2.08,3.81 | 2,3.83 2.08,3.73 | U$1.F2 2.08,3.73 | 2,3.83 2.13,3.85 | U$1.F2 2.13,3.85 | 2,3.71 2.13,3.7 | U$1.F2 2.13,3.7
  Route2 0.1: 2,3.71 2.08,3.81 | U$1.F2 2.08,3.81 | U$1.F2 2.09,3.72 1.99,3.81 2.12,3.84 U$1.F2 | U$1.F2 2.15,3.7 2.02,3.68 2.07,3.8 U$1.F2 | U$1.F2 2.07,3.74 2.02,3.86 2.15,3.85 U$1.F2 | U$1.F2 2.12,3.7 2,3.73 2.09,3.82 U$1.F2 | 2,3.83 2.08,3.73 | U$1.F2 2.08,3.73 | 2,3.83 2.13,3.85 | U$1.F2 2.13,3.85 | 2,3.71 2.13,3.7 | U$1.F2 2.13,3.7 | 2,3.71 2.08,3.81 | U$1.F2 2.08,3.81 | 2,3.83 2.08,3.73 | U$1.F2 2.08,3.73 | 2,3.83 2.13,3.85 | U$1.F2 2.13,3.85 | 2,3.71 2.13,3.7 | U$1.F2 2.13,3.7 | 2,3.71 2.08,3.81 | U$1.F2 2.08,3.81 | 2.11,3.77 1.89,3.9 | v1.81,3.77 1.89,3.9 | 2.11,3.77 1.89,3.64 | v1.81,3.77 1.89,3.64 | 2.11,3.71 1.91,3.88 | v1.81,3.77 1.91,3.88 | 2.11,3.71 1.86,3.63 | v1.81,3.77 1.86,3.63 | 2.11,3.83 1.86,3.91 | v1.81,3.77 1.86,3.91 | 2.11,3.83 1.91,3.66 | v1.81,3.77 1.91,3.66 | 2.11,3.77 1.89,3.9 | v1.81,3.77 1.89,3.9 | 2.11,3.77 1.89,3.64 | v1.81,3.77 1.89,3.64 | 2.11,3.77 1.89,3.9 | v1.81,3.77 1.89,3.9 | 2.11,3.77 1.89,3.64 | v1.81,3.77 1.89,3.64 | 2.11,3.71 1.91,3.88 | v1.81,3.77 1.91,3.88 | 2.11,3.71 1.86,3.63 | v1.81,3.77 1.86,3.63 | 2.11,3.83 1.86,3.91 | v1.81,3.77 1.86,3.91 | 2.11,3.83 1.91,3.66 | v1.81,3.77 1.91,3.66 | 2.11,3.71 1.91,3.88 | v1.81,3.77 1.91,3.88 | 2.11,3.71 1.86,3.63 | v1.81,3.77 1.86,3.63 | 2.11,3.83 1.86,3.91 | v1.81,3.77 1.86,3.91 | 2.11,3.83 1.91,3.66 | v1.81,3.77 1.91,3.66 | 2.11,3.71 1.91,3.88 | v1.81,3.77 1.91,3.88 | 2.11,3.71 1.86,3.63 | v1.81,3.77 1.86,3.63 | 2.11,3.83 1.86,3.91 | v1.81,3.77 1.86,3.91 | 2.11,3.83 1.91,3.66 | v1.81,3.77 1.91,3.66 | v1.81,3.77 1.89,3.89 2.11,3.75 1.88,3.63 v1.81,3.77 | v1.81,3.77 1.85,3.91 2.1,3.84 1.92,3.66 v1.81,3.77 | v1.81,3.77 1.92,3.88 2.1,3.7 1.85,3.62 v1.81,3.77 | v1.81,3.77 1.88,3.9 2.11,3.79 1.9,3.65 v1.81,3.77
  Route2 0.1: 2.11,3.77 1.89,3.9 | v1.81,3.77 1.89,3.9 | 2.11,3.77 1.89,3.64 | v1.81,3.77 1.89,3.64 | 2.11,3.77 1.89,3.9 | v1.81,3.77 1.89,3.9 | 2.11,3.77 1.89,3.64 | v1.81,3.77 1.89,3.64 | 2.11,3.71 1.91,3.88 | v1.81,3.77 1.91,3.88 | 2.11,3.71 1.86,3.63 | v1.81,3.77 1.86,3.63 | 2.11,3.71 1.91,3.88 | v1.81,3.77 1.91,3.88 | 2.11,3.71 1.86,3.63 | v1.81,3.77 1.86,3.63 | 2.11,3.83 1.86,3.91 | v1.81,3.77 1.86,3.91 | 2.11,3.83 1.91,3.66 | v1.81,3.77 1.91,3.66 | 2.11,3.83 1.86,3.91 | v1.81,3.77 1.86,3.91 | 2.11,3.83 1.91,3.66 | v1.81,3.77 1.91,3.66 | 2.11,3.77 1.89,3.9 | v1.81,3.77 1.89,3.9 | 2.11,3.77 1.89,3.64 | v1.81,3.77 1.89,3.64 | 2.11,3.77 1.89,3.9 | v1.81,3.77 1.89,3.9 | 2.11,3.77 1.89,3.64 | v1.81,3.77 1.89,3.64 | 2.11,3.77 1.89,3.9 | v1.81,3.77 1.89,3.9 | 2.11,3.77 1.89,3.64 | v1.81,3.77 1.89,3.64 | 2.11,3.77 1.89,3.9 | v1.81,3.77 1.89,3.9 | 2.11,3.77 1.89,3.64 | v1.81,3.77 1.89,3.64 | 4.69,5.77 4.58,5.83 | U$1.A8 4.58,5.83 | 4.69,5.77 4.58,5.7 | U$1.A8 4.58,5.7 | 4.69,5.77 4.58,5.83 | U$1.A8 4.58,5.83 | 4.69,5.77 4.58,5.7 | U$1.A8 4.58,5.7 | 4.69,5.77 4.58,5.83 | U$1.A8 4.58,5.83 | 4.69,5.77 4.58,5.7 | U$1.A8 4.58,5.7 | 4.68,5.72 4.6,5.82 | U$1.A8 4.6,5.82 | 4.68,5.72 4.55,5.7 | U$1.A8 4.55,5.7 | 4.68,5.82 4.56,5.84 | U$1.A8 4.56,5.84 | 4.68,5.82 4.6,5.72 | U$1.A8 4.6,5.72 | 4.69,5.77 4.58,5.83 | U$1.A8 4.58,5.83 | 4.69,5.77 4.58,5.7 | U$1.A8 4.58,5.7 | 4.69,5.77 4.58,5.83 | U$1.A8 4.58,5.83 | 4.69,5.77 4.58,5.7 | U$1.A8 4.58,5.7 | 4.69,5.77 4.58,5.83 | U$1.A8 4.58,5.83 | 4.69,5.77 4.58,5.7 | U$1.A8 4.58,5.7 | 4.69,5.77 4.58,5.83 | U$1.A8 4.58,5.83 | 4.69,5.77 4.58,5.7 | U$1.A8 4.58,5.7 | 4.69,5.77 4.58,5.83 | U$1.A8 4.58,5.83 | 4.69,5.77 4.58,5.7 | U$1.A8 4.58,5.7 | 4.69,5.77 4.58,5.83 | U$1.A8 4.58,5.83 | 4.69,5.77 4.58,5.7 | U$1.A8 4.58,5.7
  Route2 0.1: 4.68,5.72 4.6,5.82 | U$1.A8 4.6,5.82 | 4.68,5.72 4.55,5.7 | U$1.A8 4.55,5.7 | 4.68,5.72 4.6,5.82 | U$1.A8 4.6,5.82 | 4.68,5.72 4.55,5.7 | U$1.A8 4.55,5.7 | 4.68,5.82 4.56,5.84 | U$1.A8 4.56,5.84 | 4.68,5.82 4.6,5.72 | U$1.A8 4.6,5.72 | 4.68,5.82 4.56,5.84 | U$1.A8 4.56,5.84 | 4.68,5.82 4.6,5.72 | U$1.A8 4.6,5.72 | 4.68,5.72 4.6,5.82 | U$1.A8 4.6,5.82 | 4.68,5.72 4.55,5.7 | U$1.A8 4.55,5.7 | 4.68,5.82 4.56,5.84 | U$1.A8 4.56,5.84 | 4.68,5.82 4.6,5.72 | U$1.A8 4.6,5.72 | U$1.A8 4.59,5.83 4.69,5.75 4.57,5.7 U$1.A8 | U$1.A8 4.54,5.84 4.67,5.85 4.61,5.73 U$1.A8 | U$1.A8 4.61,5.8 4.67,5.69 4.54,5.7 U$1.A8 | U$1.A8 4.57,5.84 4.69,5.79 4.59,5.71 U$1.A8 | 4.68,5.72 4.6,5.82 | U$1.A8 4.6,5.82 | 4.68,5.72 4.55,5.7 | U$1.A8 4.55,5.7 | 4.68,5.82 4.56,5.84 | U$1.A8 4.56,5.84 | 4.68,5.82 4.6,5.72 | U$1.A8 4.6,5.72 | 4.68,5.72 4.6,5.82 | U$1.A8 4.6,5.82 | 4.68,5.72 4.55,5.7 | U$1.A8 4.55,5.7 | 4.68,5.82 4.56,5.84 | U$1.A8 4.56,5.84 | 4.68,5.82 4.6,5.72 | U$1.A8 4.6,5.72 | 4.59,5.77 4.82,5.64 | v4.89,5.76 4.82,5.64 | 4.59,5.77 4.82,5.9 | v4.89,5.76 4.82,5.9 | 4.6,5.82 4.8,5.65 | v4.89,5.76 4.8,5.65 | 4.6,5.82 4.84,5.91 | v4.89,5.76 4.84,5.91 | 4.6,5.72 4.84,5.62 | v4.89,5.76 4.84,5.62 | 4.6,5.72 4.8,5.88 | v4.89,5.76 4.8,5.88 | 4.59,5.77 4.82,5.64 | v4.89,5.76 4.82,5.64 | 4.59,5.77 4.82,5.9 | v4.89,5.76 4.82,5.9 | 4.59,5.77 4.82,5.64 | v4.89,5.76 4.82,5.64 | 4.59,5.77 4.82,5.9 | v4.89,5.76 4.82,5.9 | 4.6,5.82 4.8,5.65 | v4.89,5.76 4.8,5.65 | 4.6,5.82 4.84,5.91 | v4.89,5.76 4.84,5.91 | 4.6,5.72 4.84,5.62 | v4.89,5.76 4.84,5.62 | 4.6,5.72 4.8,5.88 | v4.89,5.76 4.8,5.88 | 4.6,5.82 4.8,5.65 | v4.89,5.76 4.8,5.65 | 4.6,5.82 4.84,5.91 | v4.89,5.76 4.84,5.91 | 4.6,5.72 4.84,5.62 | v4.89,5.76 4.84,5.62 | 4.6,5.72 4.8,5.88 | v4.89,5.76 4.8,5.88
  Route2 0.1: 4.6,5.82 4.8,5.65 | v4.89,5.76 4.8,5.65 | 4.6,5.82 4.84,5.91 | v4.89,5.76 4.84,5.91 | 4.6,5.72 4.84,5.62 | v4.89,5.76 4.84,5.62 | 4.6,5.72 4.8,5.88 | v4.89,5.76 4.8,5.88 | 4.6,5.82 4.8,5.65 v4.89,5.76 | 4.6,5.82 4.84,5.91 v4.89,5.76 | v4.89,5.76 4.85,5.62 4.6,5.7 4.79,5.88 v4.89,5.76 | v4.89,5.76 4.79,5.66 4.6,5.83 4.85,5.91 v4.89,5.76 | v4.89,5.76 4.84,5.63 4.6,5.72 4.8,5.88 v4.89,5.76 | 4.59,5.77 4.82,5.64 | v4.89,5.76 4.82,5.64 | 4.59,5.77 4.82,5.9 | v4.89,5.76 4.82,5.9 | 4.59,5.77 4.82,5.64 | v4.89,5.76 4.82,5.64 | 4.59,5.77 4.82,5.9 | v4.89,5.76 4.82,5.9 | 4.6,5.82 4.8,5.65 | v4.89,5.76 4.8,5.65 | 4.6,5.82 4.84,5.91 | v4.89,5.76 4.84,5.91 | 4.6,5.82 4.8,5.65 | v4.89,5.76 4.8,5.65 | 4.6,5.82 4.84,5.91 | v4.89,5.76 4.84,5.91 | 4.6,5.72 4.84,5.62 | v4.89,5.76 4.84,5.62 | 4.6,5.72 4.8,5.88 | v4.89,5.76 4.8,5.88 | 4.6,5.72 4.84,5.62 | v4.89,5.76 4.84,5.62 | 4.6,5.72 4.8,5.88 | v4.89,5.76 4.8,5.88 | 4.59,5.77 4.82,5.64 | v4.89,5.76 4.82,5.64 | 4.59,5.77 4.82,5.9 | v4.89,5.76 4.82,5.9 | 4.59,5.77 4.82,5.64 | v4.89,5.76 4.82,5.64 | 4.59,5.77 4.82,5.9 | v4.89,5.76 4.82,5.9 | 4.59,5.77 4.82,5.64 | v4.89,5.76 4.82,5.64 | 4.59,5.77 4.82,5.9 | v4.89,5.76 4.82,5.9 | 4.59,5.77 4.82,5.64 | v4.89,5.76 4.82,5.64 | 4.59,5.77 4.82,5.9 | v4.89,5.76 4.82,5.9 | 2.11,4.52 U$1.D2 | U$1.A4 2.97,5.8
  Bottom 0.1: C7.1 5.26,0.48 v5.69,0.4 | C1.1 6.81,8.62 v7.2,8.62 | 4.14,9.75 C2.1 4.13,9.83 v3.61,9.81 | v1.52,2.25 1.75,1.93 C8.1 | U$4.P$29 2.85,3.48 3.3,2.94 3.53,2.95 3.75,2.72 v3.75,2.38 v3.75,2.39 v3.74,2.39 | U$4.P$14 7.66,6.57 7.66,7.21 7.84,7.39 8.91,7.39 v9.11,7.59 | C9.1 7.37,8.45 v7.2,8.62 | 5.39,0.46 5.59,0.29 | v5.69,0.4 5.59,0.29 | 5.39,0.46 5.64,0.54 | v5.69,0.4 5.64,0.54 | 3.75,2.69 3.61,2.47 | v3.74,2.39 3.61,2.47 | 3.75,2.69 3.87,2.46 | v3.74,2.39 3.87,2.46 | 8.89,7.39 9.14,7.45 | v9.11,7.59 9.14,7.45 | 8.89,7.39 8.97,7.64 | v9.11,7.59 8.97,7.64 | 3.91,9.82 3.69,9.94 | v3.61,9.81 3.69,9.94 | 3.91,9.82 3.69,9.68 | v3.61,9.81 3.69,9.68 | 6.9,8.62 7.12,8.49 | v7.2,8.62 7.12,8.49 | 6.9,8.62 7.12,8.75 | v7.2,8.62 7.12,8.75 | 7.44,8.45 7.33,8.69 | v7.2,8.62 7.33,8.69 | 7.44,8.45 7.19,8.47 | v7.2,8.62 7.19,8.47 | 1.69,2 1.67,2.26 | v1.52,2.25 1.67,2.26 | 1.69,2 1.46,2.12 | v1.52,2.25 1.46,2.12 | 5.39,0.46 5.59,0.29 | v5.69,0.4 5.59,0.29 | 5.39,0.46 5.64,0.54 | v5.69,0.4 5.64,0.54 | 5.39,0.46 5.59,0.29 | v5.69,0.4 5.59,0.29 | 5.39,0.46 5.64,0.54 | v5.69,0.4 5.64,0.54 | 5.39,0.46 5.59,0.29 | v5.69,0.4 5.59,0.29 | 5.39,0.46 5.64,0.54 | v5.69,0.4 5.64,0.54 | 3.75,2.69 3.61,2.47 | v3.74,2.39 3.61,2.47 | 3.75,2.69 3.87,2.46 | v3.74,2.39 3.87,2.46 | 3.75,2.69 3.61,2.47 | v3.74,2.39 3.61,2.47 | 3.75,2.69 3.87,2.46 | v3.74,2.39 3.87,2.46 | 3.75,2.69 3.61,2.47 | v3.74,2.39 3.61,2.47 | 3.75,2.69 3.87,2.46 | v3.74,2.39 3.87,2.46 | 8.89,7.39 9.14,7.45 | v9.11,7.59 9.14,7.45 | 8.89,7.39 8.97,7.64 | v9.11,7.59 8.97,7.64 | 8.89,7.39 9.14,7.45 | v9.11,7.59 9.14,7.45 | 8.89,7.39 8.97,7.64 | v9.11,7.59 8.97,7.64 | 8.89,7.39 9.14,7.45 | v9.11,7.59 9.14,7.45 | 8.89,7.39 8.97,7.64 | v9.11,7.59 8.97,7.64 | 3.91,9.82 3.69,9.94
  Bottom 0.1: v3.61,9.81 3.69,9.94 | 3.91,9.82 3.69,9.68 | v3.61,9.81 3.69,9.68 | 3.91,9.82 3.69,9.94 | v3.61,9.81 3.69,9.94 | 3.91,9.82 3.69,9.68 | v3.61,9.81 3.69,9.68 | 3.91,9.82 3.69,9.94 | v3.61,9.81 3.69,9.94 | 3.91,9.82 3.69,9.68 | v3.61,9.81 3.69,9.68 | 6.9,8.62 7.12,8.49 | v7.2,8.62 7.12,8.49 | 6.9,8.62 7.12,8.75 | v7.2,8.62 7.12,8.75 | 7.44,8.45 7.33,8.69 | v7.2,8.62 7.33,8.69 | 7.44,8.45 7.19,8.47 | v7.2,8.62 7.19,8.47 | 6.9,8.62 7.12,8.49 | v7.2,8.62 7.12,8.49 | 6.9,8.62 7.12,8.75 | v7.2,8.62 7.12,8.75 | 6.9,8.62 7.12,8.49 | v7.2,8.62 7.12,8.49 | 6.9,8.62 7.12,8.75 | v7.2,8.62 7.12,8.75 | 7.44,8.45 7.33,8.69 | v7.2,8.62 7.33,8.69 | 7.44,8.45 7.19,8.47 | v7.2,8.62 7.19,8.47 | 7.44,8.45 7.33,8.69 | v7.2,8.62 7.33,8.69 | 7.44,8.45 7.19,8.47 | v7.2,8.62 7.19,8.47 | 1.69,2 1.67,2.26 | v1.52,2.25 1.67,2.26 | 1.69,2 1.46,2.12 | v1.52,2.25 1.46,2.12 | 1.69,2 1.67,2.26 | v1.52,2.25 1.67,2.26 | 1.69,2 1.46,2.12 | v1.52,2.25 1.46,2.12 | 1.69,2 1.67,2.26 | v1.52,2.25 1.67,2.26 | 1.69,2 1.46,2.12 | v1.52,2.25 1.46,2.12 | 5.39,0.46 5.59,0.29 | v5.69,0.4 5.59,0.29 | 5.39,0.46 5.64,0.54 | v5.69,0.4 5.64,0.54 | 5.39,0.46 5.59,0.29 | v5.69,0.4 5.59,0.29 | 5.39,0.46 5.64,0.54 | v5.69,0.4 5.64,0.54 | 5.39,0.46 5.59,0.29 | v5.69,0.4 5.59,0.29 | 5.39,0.46 5.64,0.54 | v5.69,0.4 5.64,0.54 | 5.39,0.46 5.59,0.29 | v5.69,0.4 5.59,0.29 | 5.39,0.46 5.64,0.54 | v5.69,0.4 5.64,0.54 | 5.39,0.46 5.59,0.29 | v5.69,0.4 5.59,0.29 | 5.39,0.46 5.64,0.54 | v5.69,0.4 5.64,0.54 | 5.39,0.46 5.59,0.29 | v5.69,0.4 5.59,0.29 | 5.39,0.46 5.64,0.54 | v5.69,0.4 5.64,0.54 | 5.39,0.46 5.59,0.29 | v5.69,0.4 5.59,0.29 | 5.39,0.46 5.64,0.54 | v5.69,0.4 5.64,0.54 | 5.39,0.46 5.59,0.29 | v5.69,0.4 5.59,0.29 | 5.39,0.46 5.64,0.54 | v5.69,0.4 5.64,0.54 | 5.39,0.46 5.59,0.29
  Bottom 0.1: v5.69,0.4 5.59,0.29 | 5.39,0.46 5.64,0.54 | v5.69,0.4 5.64,0.54 | 3.75,2.69 3.61,2.47 | v3.74,2.39 3.61,2.47 | 3.75,2.69 3.87,2.46 | v3.74,2.39 3.87,2.46 | 3.75,2.69 3.61,2.47 | v3.74,2.39 3.61,2.47 | 3.75,2.69 3.87,2.46 | v3.74,2.39 3.87,2.46 | 3.75,2.69 3.61,2.47 | v3.74,2.39 3.61,2.47 | 3.75,2.69 3.87,2.46 | v3.74,2.39 3.87,2.46 | 3.75,2.69 3.61,2.47 | v3.74,2.39 3.61,2.47 | 3.75,2.69 3.87,2.46 | v3.74,2.39 3.87,2.46 | 3.75,2.69 3.61,2.47 | v3.74,2.39 3.61,2.47 | 3.75,2.69 3.87,2.46 | v3.74,2.39 3.87,2.46 | 3.75,2.69 3.61,2.47 | v3.74,2.39 3.61,2.47 | 3.75,2.69 3.87,2.46 | v3.74,2.39 3.87,2.46 | 3.75,2.69 3.61,2.47 | v3.74,2.39 3.61,2.47 | 3.75,2.69 3.87,2.46 | v3.74,2.39 3.87,2.46 | 3.75,2.69 3.61,2.47 | v3.74,2.39 3.61,2.47 | 3.75,2.69 3.87,2.46 | v3.74,2.39 3.87,2.46 | 3.75,2.69 3.61,2.47 | v3.74,2.39 3.61,2.47 | 3.75,2.69 3.87,2.46 | v3.74,2.39 3.87,2.46 | 8.89,7.39 9.14,7.45 | v9.11,7.59 9.14,7.45 | 8.89,7.39 8.97,7.64 | v9.11,7.59 8.97,7.64 | 8.89,7.39 9.14,7.45 | v9.11,7.59 9.14,7.45 | 8.89,7.39 8.97,7.64 | v9.11,7.59 8.97,7.64 | 8.89,7.39 9.14,7.45 | v9.11,7.59 9.14,7.45 | 8.89,7.39 8.97,7.64 | v9.11,7.59 8.97,7.64 | 8.89,7.39 9.14,7.45 | v9.11,7.59 9.14,7.45 | 8.89,7.39 8.97,7.64 | v9.11,7.59 8.97,7.64 | 8.89,7.39 9.14,7.45 | v9.11,7.59 9.14,7.45 | 8.89,7.39 8.97,7.64 | v9.11,7.59 8.97,7.64 | 8.89,7.39 9.14,7.45 | v9.11,7.59 9.14,7.45 | 8.89,7.39 8.97,7.64 | v9.11,7.59 8.97,7.64 | 8.89,7.39 9.14,7.45 | v9.11,7.59 9.14,7.45 | 8.89,7.39 8.97,7.64 | v9.11,7.59 8.97,7.64 | 8.89,7.39 9.14,7.45 | v9.11,7.59 9.14,7.45 | 8.89,7.39 8.97,7.64 | v9.11,7.59 8.97,7.64 | 8.89,7.39 9.14,7.45 | v9.11,7.59 9.14,7.45 | 8.89,7.39 8.97,7.64 | v9.11,7.59 8.97,7.64 | 3.91,9.82 3.69,9.94 | v3.61,9.81 3.69,9.94 | 3.91,9.82 3.69,9.68
  Bottom 0.1: v3.61,9.81 3.69,9.68 | 3.91,9.82 3.69,9.94 | v3.61,9.81 3.69,9.94 | 3.91,9.82 3.69,9.68 | v3.61,9.81 3.69,9.68 | 3.91,9.82 3.69,9.94 | v3.61,9.81 3.69,9.94 | 3.91,9.82 3.69,9.68 | v3.61,9.81 3.69,9.68 | 3.91,9.82 3.69,9.94 | v3.61,9.81 3.69,9.94 | 3.91,9.82 3.69,9.68 | v3.61,9.81 3.69,9.68 | 3.91,9.82 3.69,9.94 | v3.61,9.81 3.69,9.94 | 3.91,9.82 3.69,9.68 | v3.61,9.81 3.69,9.68 | 3.91,9.82 3.69,9.94 | v3.61,9.81 3.69,9.94 | 3.91,9.82 3.69,9.68 | v3.61,9.81 3.69,9.68 | 3.91,9.82 3.69,9.94 | v3.61,9.81 3.69,9.94 | 3.91,9.82 3.69,9.68 | v3.61,9.81 3.69,9.68 | 3.91,9.82 3.69,9.94 | v3.61,9.81 3.69,9.94 | 3.91,9.82 3.69,9.68 | v3.61,9.81 3.69,9.68 | 3.91,9.82 3.69,9.94 | v3.61,9.81 3.69,9.94 | 3.91,9.82 3.69,9.68 | v3.61,9.81 3.69,9.68 | 6.9,8.62 7.12,8.49 | v7.2,8.62 7.12,8.49 | 6.9,8.62 7.12,8.75 | v7.2,8.62 7.12,8.75 | 7.44,8.45 7.33,8.69 | v7.2,8.62 7.33,8.69 | 7.44,8.45 7.19,8.47 | v7.2,8.62 7.19,8.47 | 6.9,8.62 7.12,8.49 | v7.2,8.62 7.12,8.49 | 6.9,8.62 7.12,8.75 | v7.2,8.62 7.12,8.75 | 6.9,8.62 7.12,8.49 | v7.2,8.62 7.12,8.49 | 6.9,8.62 7.12,8.75 | v7.2,8.62 7.12,8.75 | 7.44,8.45 7.33,8.69 | v7.2,8.62 7.33,8.69 | 7.44,8.45 7.19,8.47 | v7.2,8.62 7.19,8.47 | 7.44,8.45 7.33,8.69 | v7.2,8.62 7.33,8.69 | 7.44,8.45 7.19,8.47 | v7.2,8.62 7.19,8.47 | 6.9,8.62 7.12,8.49 | v7.2,8.62 7.12,8.49 | 6.9,8.62 7.12,8.75 | v7.2,8.62 7.12,8.75 | 6.9,8.62 7.12,8.49 | v7.2,8.62 7.12,8.49 | 6.9,8.62 7.12,8.75 | v7.2,8.62 7.12,8.75 | 7.44,8.45 7.33,8.69 | v7.2,8.62 7.33,8.69 | 7.44,8.45 7.19,8.47 | v7.2,8.62 7.19,8.47 | 7.44,8.45 7.33,8.69 | v7.2,8.62 7.33,8.69 | 7.44,8.45 7.19,8.47 | v7.2,8.62 7.19,8.47 | 6.9,8.62 7.12,8.49 | v7.2,8.62 7.12,8.49 | 6.9,8.62 7.12,8.75 | v7.2,8.62 7.12,8.75 | 6.9,8.62 7.12,8.49 | v7.2,8.62 7.12,8.49
  Bottom 0.1: 6.9,8.62 7.12,8.75 | v7.2,8.62 7.12,8.75 | 6.9,8.62 7.12,8.49 | v7.2,8.62 7.12,8.49 | 6.9,8.62 7.12,8.75 | v7.2,8.62 7.12,8.75 | 6.9,8.62 7.12,8.49 | v7.2,8.62 7.12,8.49 | 6.9,8.62 7.12,8.75 | v7.2,8.62 7.12,8.75 | 7.44,8.45 7.33,8.69 | v7.2,8.62 7.33,8.69 | 7.44,8.45 7.19,8.47 | v7.2,8.62 7.19,8.47 | 7.44,8.45 7.33,8.69 | v7.2,8.62 7.33,8.69 | 7.44,8.45 7.19,8.47 | v7.2,8.62 7.19,8.47 | 7.44,8.45 7.33,8.69 | v7.2,8.62 7.33,8.69 | 7.44,8.45 7.19,8.47 | v7.2,8.62 7.19,8.47 | 7.44,8.45 7.33,8.69 | v7.2,8.62 7.33,8.69 | 7.44,8.45 7.19,8.47 | v7.2,8.62 7.19,8.47 | 1.69,2 1.67,2.26 | v1.52,2.25 1.67,2.26 | 1.69,2 1.46,2.12 | v1.52,2.25 1.46,2.12 | 1.69,2 1.67,2.26 | v1.52,2.25 1.67,2.26 | 1.69,2 1.46,2.12 | v1.52,2.25 1.46,2.12 | 1.69,2 1.67,2.26 | v1.52,2.25 1.67,2.26 | 1.69,2 1.46,2.12 | v1.52,2.25 1.46,2.12 | 1.69,2 1.67,2.26 | v1.52,2.25 1.67,2.26 | 1.69,2 1.46,2.12 | v1.52,2.25 1.46,2.12 | 1.69,2 1.67,2.26 | v1.52,2.25 1.67,2.26 | 1.69,2 1.46,2.12 | v1.52,2.25 1.46,2.12 | 1.69,2 1.67,2.26 | v1.52,2.25 1.67,2.26 | 1.69,2 1.46,2.12 | v1.52,2.25 1.46,2.12 | 1.69,2 1.67,2.26 | v1.52,2.25 1.67,2.26 | 1.69,2 1.46,2.12 | v1.52,2.25 1.46,2.12 | 1.69,2 1.67,2.26 | v1.52,2.25 1.67,2.26 | 1.69,2 1.46,2.12 | v1.52,2.25 1.46,2.12 | 1.69,2 1.67,2.26 | v1.52,2.25 1.67,2.26 | 1.69,2 1.46,2.12 | v1.52,2.25 1.46,2.12
  other vias: 2.94,5.77 2.14,4.57 2.14,3.77 4.54,5.77
  pour Route14 (isolate 0.125): 5.29,-0.01 5.28,-0.01 arc-90 0.04,5.23 arc-90 5.3,10.49 arc-90 10.53,5.24 arc-90 5.3,-0.01
N$3
  Top 0.1: U$1.B8 4.78,5.38 5.27,5.86 6.09,6.69 6.09,7.04 6.09,7.35 6.33,7.58 6.46,7.71 6.91,8.16 7.68,8.16 C3.1
N$29  (via drill 0.1 pad 0.25 layers 1-2)
  Top 0.1: R3.2 2.54,1.41 v2.94,1.06 | 2.82,1.16 2.86,1.04 | v2.94,1.06 2.86,1.04 | 2.82,1.16 2.95,1.13 | v2.94,1.06 2.95,1.13 | 2.82,1.16 2.86,1.04 | v2.94,1.06 2.86,1.04 | 2.82,1.16 2.95,1.13 | v2.94,1.06 2.95,1.13 | 2.82,1.16 2.86,1.04 | v2.94,1.06 2.86,1.04 | 2.82,1.16 2.95,1.13 | v2.94,1.06 2.95,1.13 | 2.82,1.16 2.86,1.04 | v2.94,1.06 2.86,1.04 | 2.82,1.16 2.95,1.13 | v2.94,1.06 2.95,1.13 | 2.82,1.16 2.86,1.04 | v2.94,1.06 2.86,1.04 | 2.82,1.16 2.95,1.13 | v2.94,1.06 2.95,1.13 | 2.82,1.16 2.86,1.04 | v2.94,1.06 2.86,1.04 | 2.82,1.16 2.95,1.13 | v2.94,1.06 2.95,1.13 | 2.82,1.16 2.86,1.04 | v2.94,1.06 2.86,1.04 | 2.82,1.16 2.95,1.13 | v2.94,1.06 2.95,1.13 | 2.82,1.16 2.86,1.04 | v2.94,1.06 2.86,1.04 | 2.82,1.16 2.95,1.13 | v2.94,1.06 2.95,1.13 | 2.82,1.16 2.86,1.04 | v2.94,1.06 2.86,1.04 | 2.82,1.16 2.95,1.13 | v2.94,1.06 2.95,1.13 | 2.82,1.16 2.86,1.04 | v2.94,1.06 2.86,1.04 | 2.82,1.16 2.95,1.13 | v2.94,1.06 2.95,1.13 | 2.82,1.16 2.86,1.04 | v2.94,1.06 2.86,1.04 | 2.82,1.16 2.95,1.13 | v2.94,1.06 2.95,1.13 | 2.82,1.16 2.86,1.04 | v2.94,1.06 2.86,1.04 | 2.82,1.16 2.95,1.13 | v2.94,1.06 2.95,1.13 | 2.82,1.16 2.86,1.04 | v2.94,1.06 2.86,1.04 | 2.82,1.16 2.95,1.13 | v2.94,1.06 2.95,1.13 | U$1.G2
  Route2 0.1: v2.94,1.06 2.87,1.06 2.12,1.81 2.12,3.34 U$1.G2 | 2.12,3.22 2.2,3.33 | U$1.G2 2.2,3.33 | 2.12,3.22 2.07,3.34 | U$1.G2 2.07,3.34 | 2.8,1.12 2.87,1.02 | v2.94,1.06 2.87,1.02 | 2.8,1.12 2.93,1.13 | v2.94,1.06 2.93,1.13 | 2.12,3.22 2.2,3.33 | U$1.G2 2.2,3.33 | 2.12,3.22 2.07,3.34 | U$1.G2 2.07,3.34 | 2.12,3.22 2.2,3.33 | U$1.G2 2.2,3.33 | 2.12,3.22 2.07,3.34 | U$1.G2 2.07,3.34 | 2.12,3.22 2.2,3.33 | U$1.G2 2.2,3.33 | 2.12,3.22 2.07,3.34 | U$1.G2 2.07,3.34 | 2.8,1.12 2.87,1.02 | v2.94,1.06 2.87,1.02 | 2.8,1.12 2.93,1.13 | v2.94,1.06 2.93,1.13 | 2.8,1.12 2.87,1.02 | v2.94,1.06 2.87,1.02 | 2.8,1.12 2.93,1.13 | v2.94,1.06 2.93,1.13 | 2.8,1.12 2.87,1.02 | v2.94,1.06 2.87,1.02 | 2.8,1.12 2.93,1.13 | v2.94,1.06 2.93,1.13 | 2.12,3.22 2.2,3.33 | U$1.G2 2.2,3.33 | 2.12,3.22 2.07,3.34 | U$1.G2 2.07,3.34 | 2.12,3.22 2.2,3.33 | U$1.G2 2.2,3.33 | 2.12,3.22 2.07,3.34 | U$1.G2 2.07,3.34 | 2.12,3.22 2.2,3.33 | U$1.G2 2.2,3.33 | 2.12,3.22 2.07,3.34 | U$1.G2 2.07,3.34 | 2.12,3.22 2.2,3.33 | U$1.G2 2.2,3.33 | 2.12,3.22 2.07,3.34 | U$1.G2 2.07,3.34 | 2.12,3.22 2.2,3.33 | U$1.G2 2.2,3.33 | 2.12,3.22 2.07,3.34 | U$1.G2 2.07,3.34 | 2.12,3.22 2.2,3.33 | U$1.G2 2.2,3.33 | 2.12,3.22 2.07,3.34 | U$1.G2 2.07,3.34 | 2.12,3.22 2.2,3.33 | U$1.G2 2.2,3.33 | 2.12,3.22 2.07,3.34 | U$1.G2 2.07,3.34 | 2.12,3.22 2.2,3.33 | U$1.G2 2.2,3.33 | 2.12,3.22 2.07,3.34 | U$1.G2 2.07,3.34 | 2.12,3.22 2.2,3.33 | U$1.G2 2.2,3.33 | 2.12,3.22 2.07,3.34 | U$1.G2 2.07,3.34 | 2.8,1.12 2.87,1.02 | v2.94,1.06 2.87,1.02 | 2.8,1.12 2.93,1.13 | v2.94,1.06 2.93,1.13 | 2.8,1.12 2.87,1.02 | v2.94,1.06 2.87,1.02 | 2.8,1.12 2.93,1.13 | v2.94,1.06 2.93,1.13 | 2.8,1.12 2.87,1.02 | v2.94,1.06 2.87,1.02 | 2.8,1.12 2.93,1.13 | v2.94,1.06 2.93,1.13 | 2.8,1.12 2.87,1.02 | v2.94,1.06 2.87,1.02
  Route2 0.1: 2.8,1.12 2.93,1.13 | v2.94,1.06 2.93,1.13 | 2.8,1.12 2.87,1.02 | v2.94,1.06 2.87,1.02 | 2.8,1.12 2.93,1.13 | v2.94,1.06 2.93,1.13 | 2.8,1.12 2.87,1.02 | v2.94,1.06 2.87,1.02 | 2.8,1.12 2.93,1.13 | v2.94,1.06 2.93,1.13 | 2.8,1.12 2.87,1.02 | v2.94,1.06 2.87,1.02 | 2.8,1.12 2.93,1.13 | v2.94,1.06 2.93,1.13 | 2.8,1.12 2.87,1.02 | v2.94,1.06 2.87,1.02 | 2.8,1.12 2.93,1.13 | v2.94,1.06 2.93,1.13 | 2.8,1.12 2.87,1.02 | v2.94,1.06 2.87,1.02 | 2.8,1.12 2.93,1.13 | v2.94,1.06 2.93,1.13
  other vias: 2.14,3.37
P1_0_ENABLE  (via drill 0.1 pad 0.25 layers 1-2, 0.2 pad 0.4)
  Top 0.1: U$1.B7
  Route2 0.1: v7.65,5.03 7.31,5.37 U$1.B7 | 4.29,5.37 4.18,5.44 | U$1.B7 4.18,5.44 | 4.29,5.37 4.18,5.31 | U$1.B7 4.18,5.31 | 7.44,5.25 7.51,4.99 | v7.65,5.03 7.51,4.99 | 7.44,5.25 7.69,5.18 | v7.65,5.03 7.69,5.18 | 4.29,5.37 4.18,5.44 | U$1.B7 4.18,5.44 | 4.29,5.37 4.18,5.31 | U$1.B7 4.18,5.31 | 4.29,5.37 4.18,5.44 | U$1.B7 4.18,5.44 | 4.29,5.37 4.18,5.31 | U$1.B7 4.18,5.31 | 4.29,5.37 4.18,5.44 | U$1.B7 4.18,5.44 | 4.29,5.37 4.18,5.31 | U$1.B7 4.18,5.31 | 7.44,5.25 7.51,4.99 | v7.65,5.03 7.51,4.99 | 7.44,5.25 7.69,5.18 | v7.65,5.03 7.69,5.18 | 7.44,5.25 7.51,4.99 | v7.65,5.03 7.51,4.99 | 7.44,5.25 7.69,5.18 | v7.65,5.03 7.69,5.18 | 7.44,5.25 7.51,4.99 | v7.65,5.03 7.51,4.99 | 7.44,5.25 7.69,5.18 | v7.65,5.03 7.69,5.18 | 4.29,5.37 4.18,5.44 | U$1.B7 4.18,5.44 | 4.29,5.37 4.18,5.31 | U$1.B7 4.18,5.31 | 4.29,5.37 4.18,5.44 | U$1.B7 4.18,5.44 | 4.29,5.37 4.18,5.31 | U$1.B7 4.18,5.31 | 4.29,5.37 4.18,5.44 | U$1.B7 4.18,5.44 | 4.29,5.37 4.18,5.31 | U$1.B7 4.18,5.31 | 4.29,5.37 4.18,5.44 | U$1.B7 4.18,5.44 | 4.29,5.37 4.18,5.31 | U$1.B7 4.18,5.31 | 4.29,5.37 4.18,5.44 | U$1.B7 4.18,5.44 | 4.29,5.37 4.18,5.31 | U$1.B7 4.18,5.31 | 4.29,5.37 4.18,5.44 | U$1.B7 4.18,5.44 | 4.29,5.37 4.18,5.31 | U$1.B7 4.18,5.31 | 4.29,5.37 4.18,5.44 | U$1.B7 4.18,5.44 | 4.29,5.37 4.18,5.31 | U$1.B7 4.18,5.31 | 4.29,5.37 4.18,5.44 | U$1.B7 4.18,5.44 | 4.29,5.37 4.18,5.31 | U$1.B7 4.18,5.31 | 4.29,5.37 4.18,5.44 | U$1.B7 4.18,5.44 | 4.29,5.37 4.18,5.31 | U$1.B7 4.18,5.31 | 7.44,5.25 7.51,4.99 | v7.65,5.03 7.51,4.99 | 7.44,5.25 7.69,5.18 | v7.65,5.03 7.69,5.18 | 7.44,5.25 7.51,4.99 | v7.65,5.03 7.51,4.99 | 7.44,5.25 7.69,5.18 | v7.65,5.03 7.69,5.18 | 7.44,5.25 7.51,4.99 | v7.65,5.03 7.51,4.99 | 7.44,5.25 7.69,5.18 | v7.65,5.03 7.69,5.18 | 7.44,5.25 7.51,4.99
  Route2 0.1: v7.65,5.03 7.51,4.99 | 7.44,5.25 7.69,5.18 | v7.65,5.03 7.69,5.18 | 7.44,5.25 7.51,4.99 | v7.65,5.03 7.51,4.99 | 7.44,5.25 7.69,5.18 | v7.65,5.03 7.69,5.18 | 7.44,5.25 7.51,4.99 | v7.65,5.03 7.51,4.99 | 7.44,5.25 7.69,5.18 | v7.65,5.03 7.69,5.18 | 7.44,5.25 7.51,4.99 | v7.65,5.03 7.51,4.99 | 7.44,5.25 7.69,5.18 | v7.65,5.03 7.69,5.18 | 7.44,5.25 7.51,4.99 | v7.65,5.03 7.51,4.99 | 7.44,5.25 7.69,5.18 | v7.65,5.03 7.69,5.18 | 7.44,5.25 7.51,4.99 | v7.65,5.03 7.51,4.99 | 7.44,5.25 7.69,5.18 | v7.65,5.03 7.69,5.18
  Bottom 0.1: U$4.P$17 v7.65,5.03 | 7.65,4.73 7.78,4.96 | v7.65,5.03 7.78,4.96 | 7.65,4.73 7.52,4.96 | v7.65,5.03 7.52,4.96 | 7.65,4.73 7.78,4.96 | v7.65,5.03 7.78,4.96 | 7.65,4.73 7.52,4.96 | v7.65,5.03 7.52,4.96 | 7.65,4.73 7.78,4.96 | v7.65,5.03 7.78,4.96 | 7.65,4.73 7.52,4.96 | v7.65,5.03 7.52,4.96 | 7.65,4.73 7.78,4.96 | v7.65,5.03 7.78,4.96 | 7.65,4.73 7.52,4.96 | v7.65,5.03 7.52,4.96 | 7.65,4.73 7.78,4.96 | v7.65,5.03 7.78,4.96 | 7.65,4.73 7.52,4.96 | v7.65,5.03 7.52,4.96 | 7.65,4.73 7.78,4.96 | v7.65,5.03 7.78,4.96 | 7.65,4.73 7.52,4.96 | v7.65,5.03 7.52,4.96 | 7.65,4.73 7.78,4.96 | v7.65,5.03 7.78,4.96 | 7.65,4.73 7.52,4.96 | v7.65,5.03 7.52,4.96 | 7.65,4.73 7.78,4.96 | v7.65,5.03 7.78,4.96 | 7.65,4.73 7.52,4.96 | v7.65,5.03 7.52,4.96 | 7.65,4.73 7.78,4.96 | v7.65,5.03 7.78,4.96 | 7.65,4.73 7.52,4.96 | v7.65,5.03 7.52,4.96 | 7.65,4.73 7.78,4.96 | v7.65,5.03 7.78,4.96 | 7.65,4.73 7.52,4.96 | v7.65,5.03 7.52,4.96 | 7.65,4.73 7.78,4.96 | v7.65,5.03 7.78,4.96 | 7.65,4.73 7.52,4.96 | v7.65,5.03 7.52,4.96 | 7.65,4.73 7.78,4.96 | v7.65,5.03 7.78,4.96 | 7.65,4.73 7.52,4.96 | v7.65,5.03 7.52,4.96 | 7.65,4.73 7.78,4.96 | v7.65,5.03 7.78,4.96 | 7.65,4.73 7.52,4.96 | v7.65,5.03 7.52,4.96
  other vias: 4.14,5.37
P1_2_TA0_1  (via drill 0.1 pad 0.25 layers 1-2, 0.2 pad 0.4, 0.2 pad 0.4 layers 2-15)
  Top 0.1: U$1.C6
  Route2 0.1: 7.1,5.77 7.33,5.65 | v7.4,5.78 7.33,5.65 | 7.1,5.77 7.32,5.91 | v7.4,5.78 7.32,5.91 | 3.73,5.12 3.67,5 | U$1.C6 3.67,5 | 3.73,5.12 3.8,5.01 | U$1.C6 3.8,5.01 | 7.1,5.77 7.33,5.65 | v7.4,5.78 7.33,5.65 | 7.1,5.77 7.32,5.91 | v7.4,5.78 7.32,5.91 | 7.1,5.77 7.33,5.65 | v7.4,5.78 7.33,5.65 | 7.1,5.77 7.32,5.91 | v7.4,5.78 7.32,5.91 | 7.1,5.77 7.33,5.65 | v7.4,5.78 7.33,5.65 | 7.1,5.77 7.32,5.91 | v7.4,5.78 7.32,5.91 | 3.73,5.12 3.67,5 | U$1.C6 3.67,5 | 3.73,5.12 3.8,5.01 | U$1.C6 3.8,5.01 | 3.73,5.12 3.67,5 | U$1.C6 3.67,5 | 3.73,5.12 3.8,5.01 | U$1.C6 3.8,5.01 | 3.73,5.12 3.67,5 | U$1.C6 3.67,5 | 3.73,5.12 3.8,5.01 | U$1.C6 3.8,5.01 | 7.1,5.77 7.33,5.65 | v7.4,5.78 7.33,5.65 | 7.1,5.77 7.32,5.91 | v7.4,5.78 7.32,5.91 | 7.1,5.77 7.33,5.65 | v7.4,5.78 7.33,5.65 | 7.1,5.77 7.32,5.91 | v7.4,5.78 7.32,5.91 | 7.1,5.77 7.33,5.65 | v7.4,5.78 7.33,5.65 | 7.1,5.77 7.32,5.91 | v7.4,5.78 7.32,5.91 | 7.1,5.77 7.33,5.65 | v7.4,5.78 7.33,5.65 | 7.1,5.77 7.32,5.91 | v7.4,5.78 7.32,5.91 | 7.1,5.77 7.33,5.65 | v7.4,5.78 7.33,5.65 | 7.1,5.77 7.32,5.91 | v7.4,5.78 7.32,5.91 | 7.1,5.77 7.33,5.65 | v7.4,5.78 7.33,5.65 | 7.1,5.77 7.32,5.91 | v7.4,5.78 7.32,5.91 | 7.1,5.77 7.33,5.65 | v7.4,5.78 7.33,5.65 | 7.1,5.77 7.32,5.91 | v7.4,5.78 7.32,5.91 | 7.1,5.77 7.33,5.65 | v7.4,5.78 7.33,5.65 | 7.1,5.77 7.32,5.91 | v7.4,5.78 7.32,5.91 | 7.1,5.77 7.33,5.65 | v7.4,5.78 7.33,5.65 | 7.1,5.77 7.32,5.91 | v7.4,5.78 7.32,5.91 | 3.73,5.12 3.67,5 | U$1.C6 3.67,5 | 3.73,5.12 3.8,5.01 | U$1.C6 3.8,5.01 | 3.73,5.12 3.67,5 | U$1.C6 3.67,5 | 3.73,5.12 3.8,5.01 | U$1.C6 3.8,5.01 | 3.73,5.12 3.67,5 | U$1.C6 3.67,5 | 3.73,5.12 3.8,5.01 | U$1.C6 3.8,5.01 | 3.73,5.12 3.67,5 | U$1.C6 3.67,5 | 3.73,5.12 3.8,5.01 | U$1.C6 3.8,5.01 | 3.73,5.12 3.67,5 | U$1.C6 3.67,5 | 3.73,5.12 3.8,5.01
  Route2 0.1: U$1.C6 3.8,5.01 | 3.73,5.12 3.67,5 | U$1.C6 3.67,5 | 3.73,5.12 3.8,5.01 | U$1.C6 3.8,5.01 | 3.73,5.12 3.67,5 | U$1.C6 3.67,5 | 3.73,5.12 3.8,5.01 | U$1.C6 3.8,5.01 | 3.73,5.12 3.67,5 | U$1.C6 3.67,5 | 3.73,5.12 3.8,5.01 | U$1.C6 3.8,5.01 | 3.73,5.12 3.67,5 | U$1.C6 3.67,5 | 3.73,5.12 3.8,5.01 | U$1.C6 3.8,5.01 | U$1.C6 3.73,5.83 4.06,6.14 5.12,6.14 5.52,5.77 7.39,5.77 v7.4,5.78